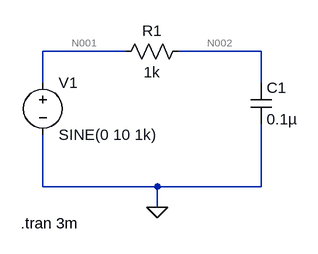
[diagram p0: schematic 3_Zadatak_lab1.asc]
3_Zadatak_lab1.asc, the LTspice schematic file:
Version 4
SHEET 1 880 680
WIRE 128 64 0 64
WIRE 336 64 208 64
WIRE 0 112 0 64
WIRE 336 112 336 64
WIRE 0 272 0 192
WIRE 176 272 0 272
WIRE 336 272 336 176
WIRE 336 272 176 272
WIRE 176 304 176 272
FLAG 176 304 0
SYMBOL res 224 48 R90
WINDOW 0 0 56 VBottom 2
WINDOW 3 32 56 VTop 2
SYMATTR InstName R1
SYMATTR Value 1k
SYMBOL cap 320 112 R0
SYMATTR InstName C1
SYMATTR Value 0.1µ
SYMBOL voltage 0 96 R0
WINDOW 123 0 0 Left 0
WINDOW 39 0 0 Left 0
SYMATTR InstName V1
SYMATTR Value SINE(0 10 1k)
TEXT -34 328 Left 2 !.tran 3m

The netlist it stands for:
* 3_Zadatak_lab1.asc
R1 N002 N001 1k
C1 N002 0 0.1µ
V1 N001 0 SINE(0 10 1k)
.tran 3m
.backanno
.end

* Results of the author's LTspice run, read from the files saved beside the schematic
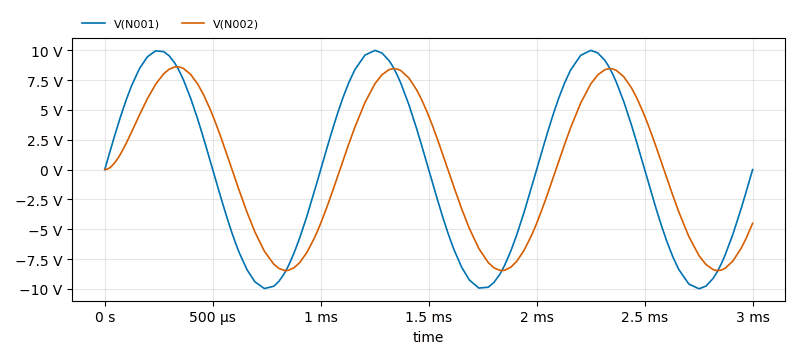
[diagram p1: Transient Analysis of 3_Zadatak_lab1.asc, plotted from the saved traces]
* Transient Analysis, 1 run:
*   V(N001): min -9.999 V, max 10 V, average 314.8 µV, rms 7.06 V, last 0 V
*   V(N002): min -8.467 V, max 8.622 V, average 150.8 mV, rms 6.013 V, last -4.505 V